# EAGLE design LNOccupancy (EAGLE 7.2.0)

## Sheet 1 of 3
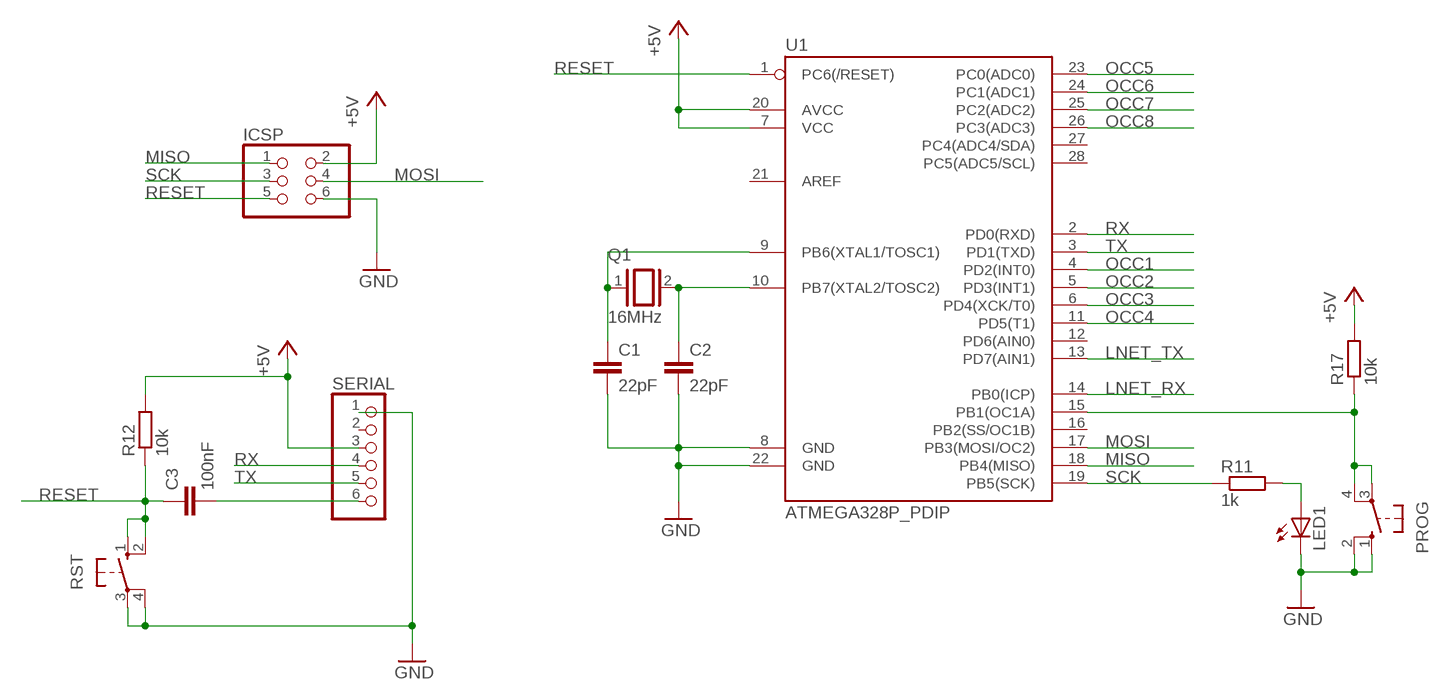
[diagram p0: schematic, sheet 1]

### Parts
C1  22pF  C-EU025-025X050  [C025-025X050]
C2  22pF  C-EU025-025X050  [C025-025X050]
C3  100nF  C-EU050-025X075  [C050-025X075]
ICSP  PINHD-2X3  [2X03]
LED1  LED3MM  [LED3MM]
PROG  10-XX  [B3F-10XX]
Q1  16MHz  XTAL/S  [QS]
R11  1k  R-EU_0207/2V  [0207/2V]
R12  10k  R-EU_0207/2V  [0207/2V]
R17  10k  R-EU_0207/2V  [0207/2V]
RST  10-XX  [B3F-10XX]
SERIAL  PINHD-1X6  [1X06]
U1  ATMEGA328P_PDIP  [DIL28-3]

### Nets
+5V: ICSP.2 R12.2 R17.2 SERIAL.3 U1.7(VCC) U1.20(AVCC) ; also sheet 2
GND: C1.2 C2.2 ICSP.6 LED1.K(C) PROG.1(S) PROG.2(S1) RST.3(P) RST.4(P1) SERIAL.1 U1.8(GND) U1.22(GND) ; also sheet 2,3
LNET_RX: U1.14(PB0(ICP)) ; also sheet 2
LNET_TX: U1.13(PD7(AIN1)) ; also sheet 2
MISO: ICSP.1 U1.18(PB4(MISO))
MOSI: ICSP.4 U1.17(PB3(MOSI/OC2))
N$4: C1.1 Q1.1 U1.9(PB6(XTAL1/TOSC1))
N$6: C2.1 Q1.2 U1.10(PB7(XTAL2/TOSC2))
N$10: LED1.A R11.2
N$11: C3.2 SERIAL.6
N$16: PROG.3(P) PROG.4(P1) R17.1 U1.15(PB1(OC1A))
OCC1: U1.4(PD2(INT0)) ; also sheet 3
OCC2: U1.5(PD3(INT1)) ; also sheet 3
OCC3: U1.6(PD4(XCK/T0)) ; also sheet 3
OCC4: U1.11(PD5(T1)) ; also sheet 3
OCC5: U1.23(PC0(ADC0)) ; also sheet 3
OCC6: U1.24(PC1(ADC1)) ; also sheet 3
OCC7: U1.25(PC2(ADC2)) ; also sheet 3
OCC8: U1.26(PC3(ADC3)) ; also sheet 3
RESET: C3.1 ICSP.5 R12.1 RST.1(S) RST.2(S1) U1.1(PC6(/RESET))
RX: SERIAL.4 U1.2(PD0(RXD))
SCK: ICSP.3 R11.1 U1.19(PB5(SCK))
TX: SERIAL.5 U1.3(PD1(TXD))
Unconnected: SERIAL.2 U1.12(PD6(AIN0)) U1.16(PB2(SS/OC1B)) U1.21(AREF) U1.27(PC4(ADC4/SDA)) U1.28(PC5(ADC5/SCL))

## Sheet 2 of 3
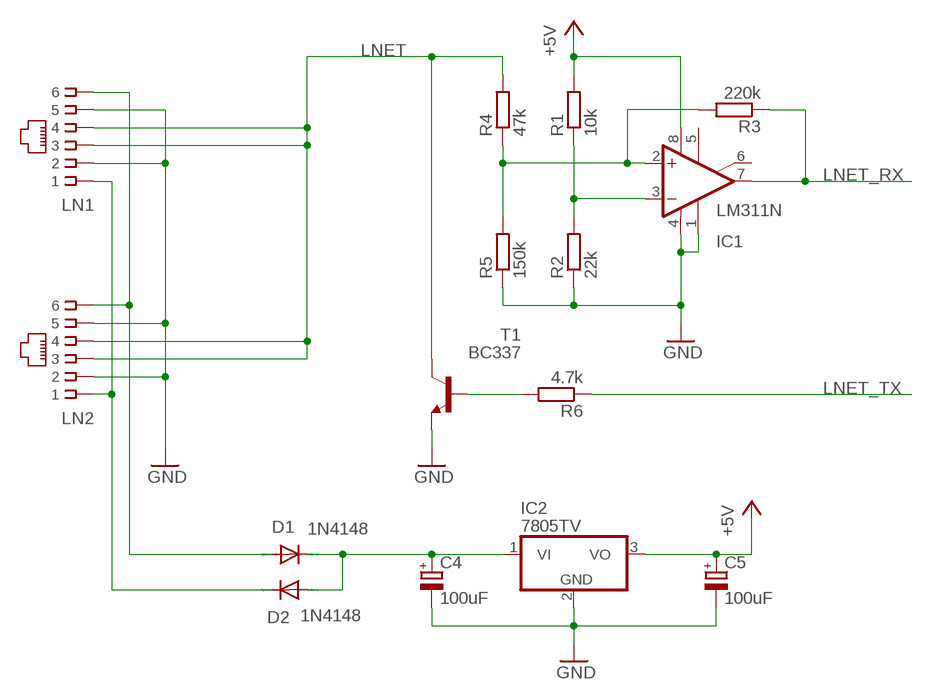
[diagram p1: schematic, sheet 2]

### Parts
C4  100uF  CPOL-EUE2.5-6  [E2,5-6]
C5  100uF  CPOL-EUE2.5-6  [E2,5-6]
D1  1N4148  1N4148DO35-10  [DO35-10]
D2  1N4148  1N4148DO35-10  [DO35-10]
IC1  LM311N  [DIL08]
IC2  7805TV  [TO220V]
LN1  RJ11-6X  [RJ11-NO_SHIELD]
LN2  RJ11-6X  [RJ11-NO_SHIELD]
R1  10k  R-EU_0207/2V  [0207/2V]
R2  22k  R-EU_0207/2V  [0207/2V]
R3  220k  R-EU_0207/2V  [0207/2V]
R4  47k  R-EU_0207/2V  [0207/2V]
R5  150k  R-EU_0207/2V  [0207/2V]
R6  4.7k  R-EU_0207/2V  [0207/2V]
T1  BC337  [TO92]

### Nets
+5V: C5.+ IC1.8(V+) IC2.3(VO) R1.2 ; also sheet 1
GND: C4.- C5.- IC1.1(GND) IC1.4(V-) IC2.2(GND) LN1.2 LN1.5 LN2.2 LN2.5 R2.1 R5.1 T1.1(E) ; also sheet 1,3
LNET: LN1.3 LN1.4 LN2.3 LN2.4 R4.2 T1.3(C)
LNET_RX: IC1.7(OUT) R3.1 ; also sheet 1
LNET_TX: R6.1 ; also sheet 1
N$1: R6.2 T1.2(B)
N$3: IC1.3(-IN) R1.1 R2.2
N$5: IC1.2(+IN) R3.2 R4.1 R5.2
N$17: C4.+ D1.C D2.A IC2.1(VI)
RAILSYNC_A [power]: D1.A LN1.6 LN2.6
RAILSYNC_B [power]: D2.C LN1.1 LN2.1
Unconnected: IC1.5(ON) IC1.6(ON/STR)

## Sheet 3 of 3
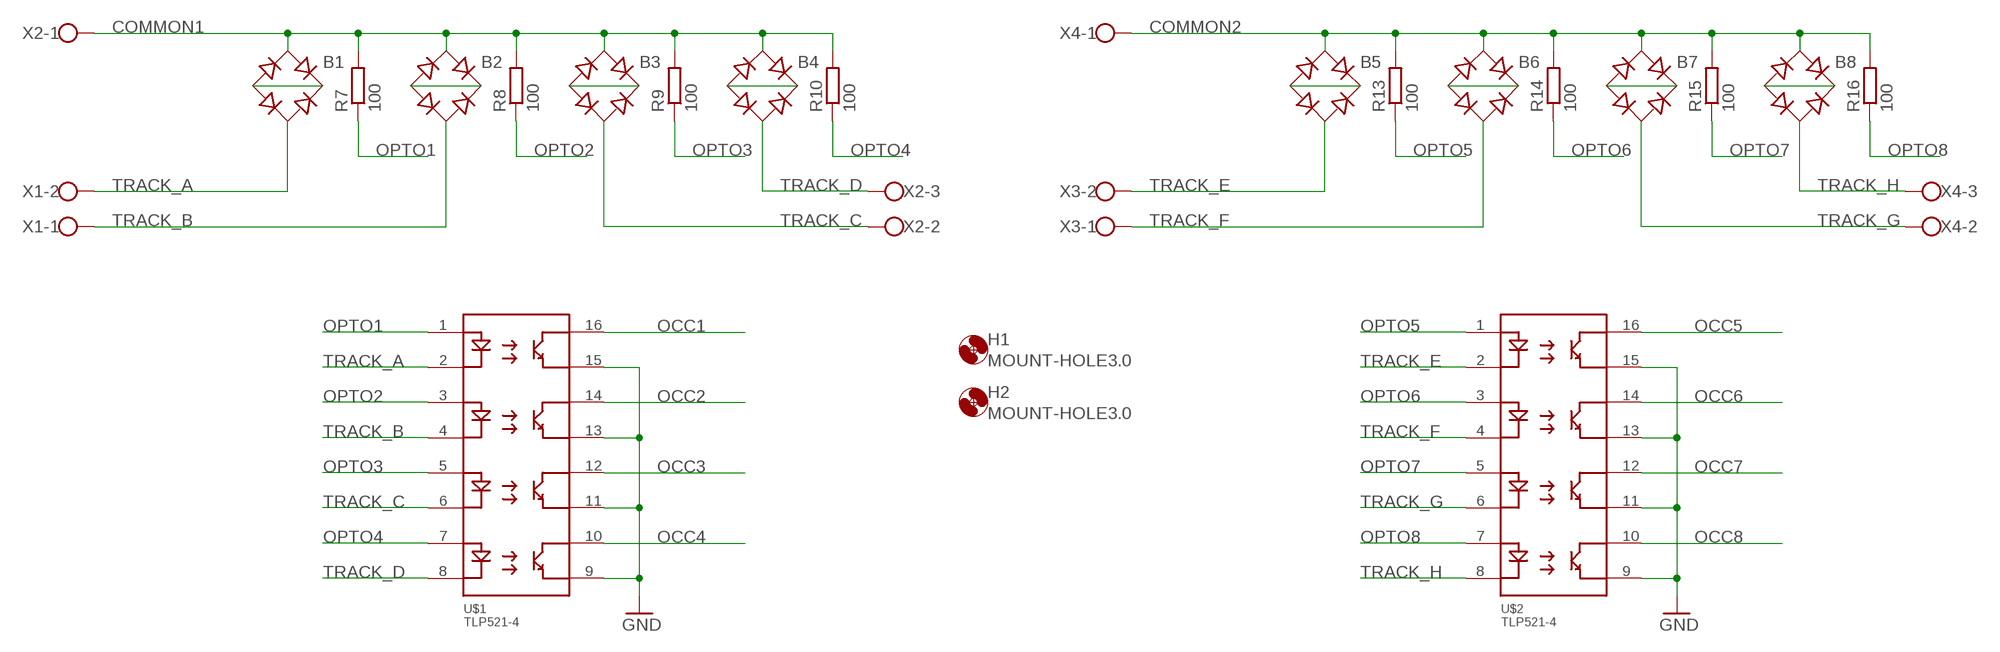
[diagram p2: schematic, sheet 3]

### Parts
B1  RB1A  [RB1A]
B2  RB1A  [RB1A]
B3  RB1A  [RB1A]
B4  RB1A  [RB1A]
B5  RB1A  [RB1A]
B6  RB1A  [RB1A]
B7  RB1A  [RB1A]
B8  RB1A  [RB1A]
H1  MOUNT-HOLE3.0  [3,0]
H2  MOUNT-HOLE3.0  [3,0]
R7  100  R-EU_0207/2V  [0207/2V]
R8  100  R-EU_0207/2V  [0207/2V]
R9  100  R-EU_0207/2V  [0207/2V]
R10  100  R-EU_0207/2V  [0207/2V]
R13  100  R-EU_0207/2V  [0207/2V]
R14  100  R-EU_0207/2V  [0207/2V]
R15  100  R-EU_0207/2V  [0207/2V]
R16  100  R-EU_0207/2V  [0207/2V]
U$1  TLP521-4  [DIL16]
U$2  TLP521-4  [DIL16]
X1  W237-102  [W237-102]
X2  W237-103  [W237-103]
X3  W237-102  [W237-102]
X4  W237-103  [W237-103]

### Nets
COMMON1 [power]: B1.AC1 B2.AC1 B3.AC1 B4.AC1 R7.2 R8.2 R9.2 R10.2 X2.1
COMMON2 [power]: B5.AC1 B6.AC1 B7.AC1 B8.AC1 R13.2 R14.2 R15.2 R16.2 X4.1
GND: U$1.9 U$1.11 U$1.13 U$1.15 U$2.9 U$2.11 U$2.13 U$2.15 ; also sheet 1,2
N$2 [power]: B1.+ B1.-
N$7 [power]: B3.+ B3.-
N$8 [power]: B4.+ B4.-
N$9 [power]: B2.+ B2.-
N$12 [power]: B5.+ B5.-
N$13 [power]: B6.+ B6.-
N$14 [power]: B7.+ B7.-
N$15 [power]: B8.+ B8.-
OCC1: U$1.16 ; also sheet 1
OCC2: U$1.14 ; also sheet 1
OCC3: U$1.12 ; also sheet 1
OCC4: U$1.10 ; also sheet 1
OCC5: U$2.16 ; also sheet 1
OCC6: U$2.14 ; also sheet 1
OCC7: U$2.12 ; also sheet 1
OCC8: U$2.10 ; also sheet 1
OPTO1: R7.1 U$1.1
OPTO2: R8.1 U$1.3
OPTO3: R9.1 U$1.5
OPTO4: R10.1 U$1.7
OPTO5: R13.1 U$2.1
OPTO6: R14.1 U$2.3
OPTO7: R15.1 U$2.5
OPTO8: R16.1 U$2.7
TRACK_A [power]: B1.AC2 U$1.2 X1.2
TRACK_B [power]: B2.AC2 U$1.4 X1.1
TRACK_C [power]: B3.AC2 U$1.6 X2.2
TRACK_D [power]: B4.AC2 U$1.8 X2.3
TRACK_E [power]: B5.AC2 U$2.2 X3.2
TRACK_F [power]: B6.AC2 U$2.4 X3.1
TRACK_G [power]: B7.AC2 U$2.6 X4.2
TRACK_H [power]: B8.AC2 U$2.8 X4.3

## Library data of the parts
B1-B8 = rectifier:RB1A: RECTIFIER 1 A
C1-C3 = rcl:C-EU: CAPACITOR, European symbol
C4 C5 = rcl:CPOL-EU: POLARIZED CAPACITOR, European symbol
D1 D2 = diode:1N4148: DIODE high speed (Philips)
H1 H2 = holes:MOUNT-HOLE: MOUNTING HOLE with drill center marker
IC1 = linear:LM311: COMPARATOR
IC2 = linear:78*: Positive VOLTAGE REGULATOR Source: http://cache.national.com/ds/LM/LM78L05.pdf http://www.fairchildsemi.com/ds/LM/LM7805.pdf
ICSP = pinhead:PINHD-2X3: PIN HEADER
LED1 = led:LED: LED OSRAM: - CHIPLED LG R971, LG N971, LY N971, LG Q971, LY Q971, LO R971, LY R971 LH N974, LH R974 LS Q976, LO Q976, LY Q976 LO Q996 - Hyper CHIPLED LW Q18S LB Q993, LB Q99A, LB R99A - SideLED LS A670, LO A670, LY A670, LG A670, LP A670 LB A673, LV A673, LT A673, LW A673 LH A674 LY A675 LS A676, LA A676, LO A676, LY A676, LW A676 LS A679, LY A679, LG A679 - Hyper Micro SIDELED® LS Y876, LA Y876, LO Y876, LY Y876 LT Y87S - SmartLED LW L88C, LW L88S LB L89C, LB L89S, LG L890 LS L89K, LO L89K, LY L89K LS L896, LA L896, LO L896, LY L896 - TOPLED LS T670, LO T670, LY T670, LG T670, LP T670 LSG T670, LSP T670, LSY T670, LOP T670, LYG T670 LG T671, LOG T671, LSG T671 LB T673, LV T673, LT T673, LW T673 LH T674 LS T676, LA T676, LO T676, LY T676, LB T676, LH T676, LSB T676, LW T676 LB T67C, LV T67C, LT T67C, LS T67K, LO T67K, LY T67K, LW E67C LS E67B, LA E67B, LO E67B, LY E67B, LB E67C, LV E67C, LT E67C LW T67C LS T679, LY T679, LG T679 LS T770, LO T770, LY T770, LG T770, LP T770 LB T773, LV T773, LT T773, LW T773 LH T774 LS E675, LA E675, LY E675, LS T675 LS T776, LA T776, LO T776, LY T776, LB T776 LHGB T686 LT T68C, LB T68C - Hyper Mini TOPLED® LB M676 - Mini TOPLED Santana® LG M470 LS M47K, LO M47K, LY M47K Source: http://www.osram.convergy.de LUXEON: - LUMILED® LXK2-PW12-R00, LXK2-PW12-S00, LXK2-PW14-U00, LXK2-PW14-V00 LXK2-PM12-R00, LXK2-PM12-S00, LXK2-PM14-U00 LXK2-PE12-Q00, LXK2-PE12-R00, LXK2-PE12-S00, LXK2-PE14-T00, LXK2-PE14-U00 LXK2-PB12-K00, LXK2-PB12-L00, LXK2-PB12-M00, LXK2-PB14-N00, LXK2-PB14-P00, LXK2-PB14-Q00 LXK2-PR12-L00, LXK2-PR12-M00, LXK2-PR14-Q00, LXK2-PR14-R00 LXK2-PD12-Q00, LXK2-PD12-R00, LXK2-PD12-S00 LXK2-PH12-R00, LXK2-PH12-S00 LXK2-PL12-P00, LXK2-PL12-Q00, LXK2-PL12-R00 Source: www.luxeon.com KINGBRIGHT: KA-3528ASYC Source: www.kingbright.com
LN1 LN2 = con-tycoelectronics:RJ11: CORCOM Modular RJ Jacks No Shield Source: www.tycoelectronics.com .. ENG_DS_1654001_1099_RJ_L_0507.pdf; MPN: RJ11-6X; OC_FARNELL: unknown; OC_NEWARK: 16R6089
PROG RST = switch-omron:10-XX: OMRON SWITCH; MPN: B3F-1000; OC_FARNELL: 176432; OC_NEWARK: 36M3542
Q1 = special:XTAL/S: CRYSTAL
R1-R17 = rcl:R-EU_: RESISTOR, European symbol
SERIAL = pinhead:PINHD-1X6: PIN HEADER
T1 = transistor:BC337: NPN TRANSISTOR
U1 = SparkFun-DigitalIC:ATMEGA328P_PDIP: uC used in the Arduino 32kb flash, 1k EEPROM, 2k SRAM This is the through-hole version of this chip.
U$1 U$2 = LD:TLP521-4
X1 X3 = con-wago-500:W237-102: WAGO SCREW CLAMP; MPN: 237-102; OC_FARNELL: unknown; OC_NEWARK: 70K9898
X2 X4 = con-wago-500:W237-103: WAGO SCREW CLAMP; MPN: 237-103; OC_FARNELL: unknown; OC_NEWARK: 18M7116

## Net classes
0 default: width 0.254 mm
1 power: width 1.016 mm

## Board
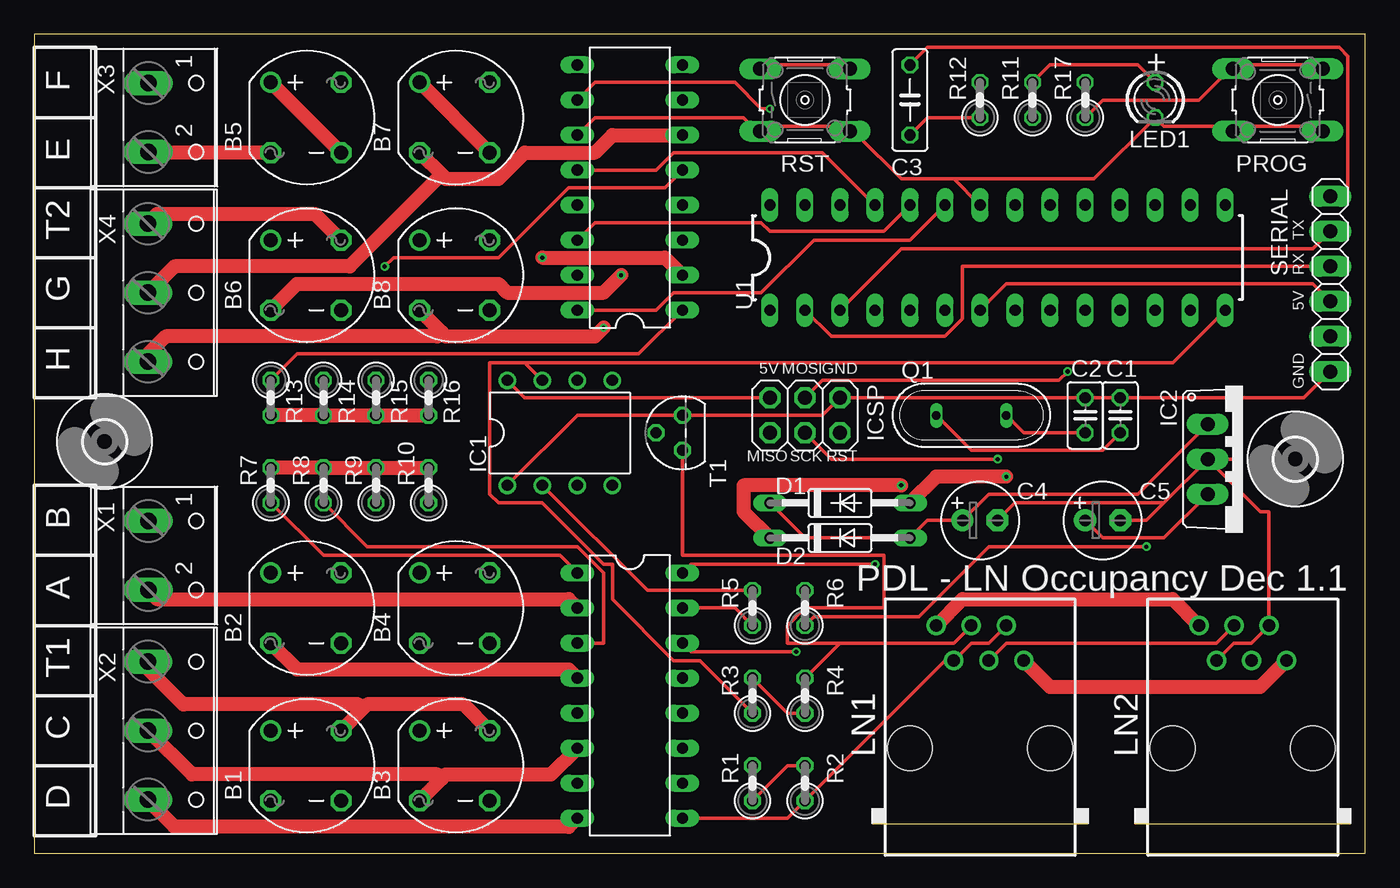
[diagram p3: board, top side]
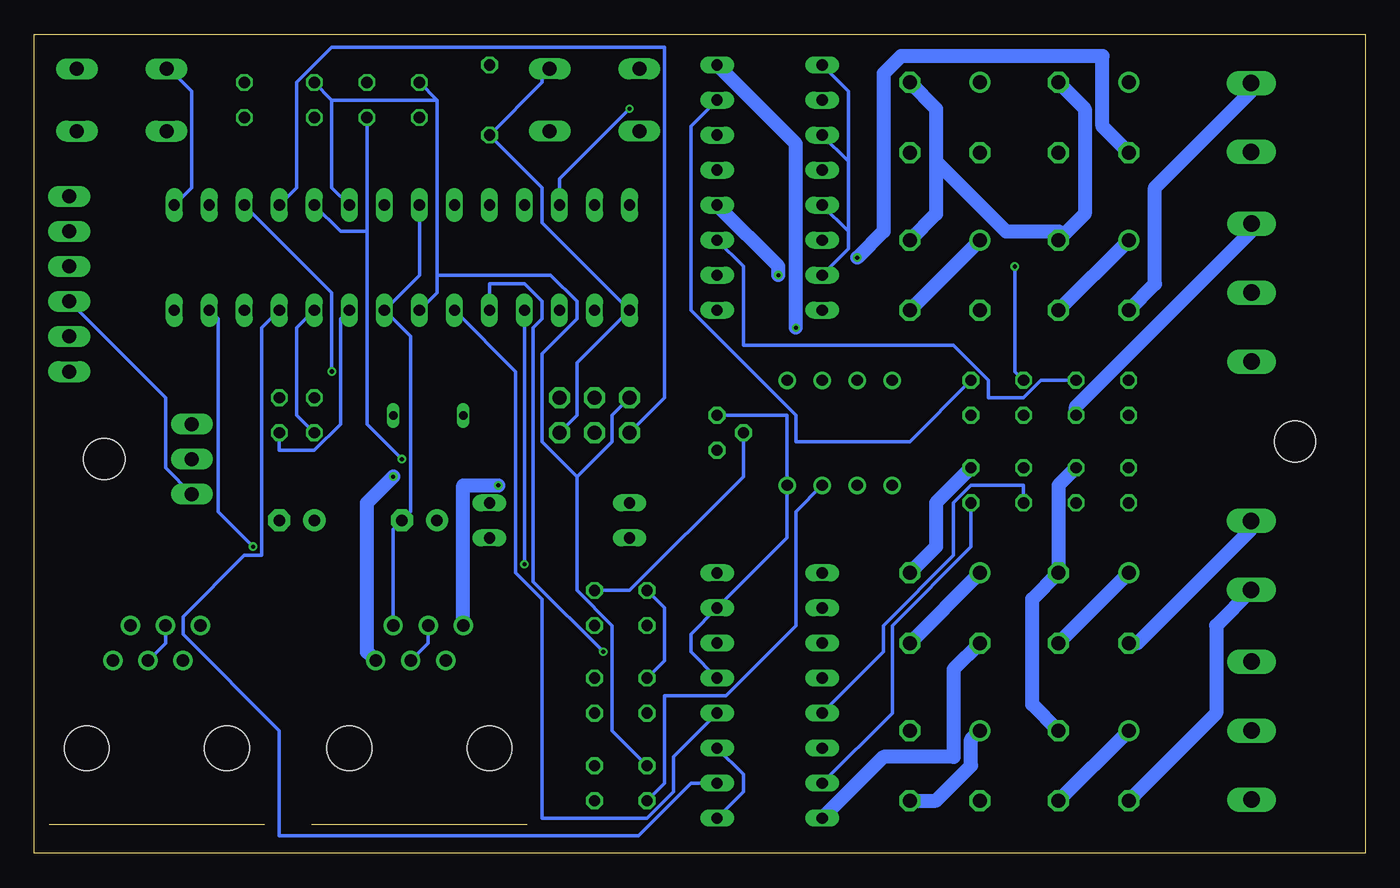
[diagram p4: board, bottom side, seen from below]

Size 96.5 x 59.36 mm. Coordinates in mm from the lower left corner, seen from the top.
Outline: 0,0 96.5,0 96.5,59.36 0,59.36 0,0
Copper layers (1*16): Top 0.035mm / dielectric 1.6mm / Bottom 0.035mm
Design rules "Elecrow_2-layer_PCB_eagle_rule": minimum track width 6mil, minimum drill 12mil, track to track 6mil, track to pad 6mil, pad to pad 6mil, via to via 8mil, smd to smd 0mil, copper to edge 20mil, drill to drill 10mil, minimum pad ring 6mil, minimum via ring 6mil, stop-mask expansion 0mil, vias tented up to drill 100mil, thermal gap 10mil

### Footprints (pad centres in the part's own frame; a part is rotated, then mirrored left to right if it is on the bottom)
RB1A = drill 1.016: + -2.54,2.54 | drill 1.016 octagon: - 2.54,-2.54; AC1 2.54,2.54; AC2 -2.54,-2.54
C025-025X050 = drill 0.813 octagon: 1 -1.27,0; 2 1.27,0
C050-025X075 = drill 0.813 octagon: 1 -2.54,0; 2 2.54,0
E2,5-6 = drill 0.813 pad 1.6: + -1.27,0 | drill 0.813 pad 1.6 octagon: - 1.27,0
DO35-10 = drill 0.813 long: A 5.08,0; C -5.08,0
3,0 = hole 3: 0,0
DIL08 = drill 0.813 pad 1.27: 1 -3.81,-3.81; 2 -1.27,-3.81; 3 1.27,-3.81; 4 3.81,-3.81; 5 3.81,3.81; 6 1.27,3.81; 7 -1.27,3.81; 8 -3.81,3.81
TO220V = drill 1.016 long: 1 -2.54,-2.54; 2 0,-2.54; 3 2.54,-2.54
2X03 = drill 1.016 octagon: 1 -2.54,-1.27; 2 -2.54,1.27; 3 0,-1.27; 4 0,1.27; 5 2.54,-1.27; 6 2.54,1.27
LED3MM = drill 0.813 octagon: A -1.27,0; K 1.27,0
RJ11-NO_SHIELD = drill 0.9 pad 1.4: 1 -3.175,8.89; 2 -1.905,6.35; 3 -0.635,8.89; 4 0.635,6.35; 5 1.905,8.89; 6 3.175,6.35 | hole 3.251: -5.08,0; 5.08,0
B3F-10XX = drill 1.016 long: 1 -3.251,2.261; 2 3.251,2.261; 3 -3.251,-2.261; 4 3.251,-2.261
QS = drill 0.61 long: 1 -2.54,0; 2 2.54,0
0207/2V = drill 0.813 octagon: 1 -1.27,0; 2 1.27,0
1X06 = drill 1.016 long: 1 -6.35,0; 2 -3.81,0; 3 -1.27,0; 4 1.27,0; 5 3.81,0; 6 6.35,0
TO92 = drill 0.813 octagon: 1 1.27,0; 2 0,1.905; 3 -1.27,0
DIL28-3 = drill 0.813 long: 1 -16.51,-3.81; 2 -13.97,-3.81; 3 -11.43,-3.81; 4 -8.89,-3.81; 5 -6.35,-3.81; 6 -3.81,-3.81; 7 -1.27,-3.81; 8 1.27,-3.81; 9 3.81,-3.81; 10 6.35,-3.81; 11 8.89,-3.81; 12 11.43,-3.81; 13 13.97,-3.81; 14 16.51,-3.81; 15 16.51,3.81; 16 13.97,3.81; 17 11.43,3.81; 18 8.89,3.81; 19 6.35,3.81; 20 3.81,3.81; 21 1.27,3.81; 22 -1.27,3.81; 23 -3.81,3.81; 24 -6.35,3.81; 25 -8.89,3.81; 26 -11.43,3.81; 27 -13.97,3.81; 28 -16.51,3.81
DIL16 = drill 0.813 long: 1 -8.89,-3.81; 2 -6.35,-3.81; 3 -3.81,-3.81; 4 -1.27,-3.81; 5 1.27,-3.81; 6 3.81,-3.81; 7 6.35,-3.81; 8 8.89,-3.81; 9 8.89,3.81; 10 6.35,3.81; 11 3.81,3.81; 12 1.27,3.81; 13 -1.27,3.81; 14 -3.81,3.81; 15 -6.35,3.81; 16 -8.89,3.81
W237-102 = drill 1.194 long: 1 -2.5,-1.27; 2 2.5,-1.27
W237-103 = drill 1.194 long: 1 -5,-1.29; 2 0,-1.29; 3 5,-1.29

### Placement (x,y rotation side)
B1  19.68,6.35 0 top
B2  19.68,17.78 0 top
B3  30.48,6.35 0 top
B4  30.48,17.78 0 top
B5  19.68,53.34 0 top
B6  19.68,41.91 0 top
B7  30.48,53.34 0 top
B8  30.48,41.91 0 top
C1  78.74,31.75 90 top
C2  76.2,31.75 90 top
C3  63.5,54.61 90 top
C4  68.58,24.13 0 top
C5  77.47,24.13 0 top
D1  58.42,25.4 0 top
D2  58.42,22.86 0 top
H1  91.44,28.57 0 top
H2  5.08,29.84 0 top
IC1  38.1,30.48 0 top
IC2  87.63,28.57 270 top
ICSP  55.88,31.75 0 top
LED1  81.28,54.61 270 top
LN1  68.58,7.62 0 top
LN2  87.63,7.62 0 top
PROG  90.17,54.61 180 top
Q1  67.94,31.75 0 top
R1  52.07,5.08 90 top
R2  55.88,5.08 90 top
R3  52.07,11.43 90 top
R4  55.88,11.43 90 top
R5  52.07,17.78 90 top
R6  55.88,17.78 90 top
R7  17.14,26.67 90 top
R8  20.95,26.67 90 top
R9  24.77,26.67 90 top
R10  28.57,26.67 90 top
R11  72.39,54.61 90 top
R12  68.58,54.61 90 top
R13  17.14,33.02 270 top
R14  20.95,33.02 270 top
R15  24.77,33.02 270 top
R16  28.57,33.02 270 top
R17  76.2,54.61 90 top
RST  55.88,54.61 0 top
SERIAL  93.98,41.27 90 top
T1  46.99,30.48 90 top
U1  69.85,43.18 0 top
U$1  43.18,11.43 270 top
U$2  43.18,48.26 90 top
X1  9.53,21.59 270 top
X2  9.53,8.89 270 top
X3  9.53,53.34 270 top
X4  9.53,40.64 270 top

### Tracks (layer width: path | path; a pad name or v marks a point on that pad's centre or on a via)
+5V
  Top 0.254: IC1.8 35.56,33.02 ICSP.2 | IC2.3 81.92,22.86 77.47,22.86 C5.+ | U1.7 70.48,41.27 92.71,41.27 SERIAL.3
  Bottom 0.254: R1.2 54.61,8.89 54.61,16.51 57.15,19.05 57.15,27.3 | 57.15,27.3 54.61,29.84 54.61,31.75 ICSP.2 | U1.20 74.93,48.26 74.93,54.61 | R17.2 74.93,54.61 | U1.7 67.31,40.64 67.31,41.91 | 67.31,54.61 67.31,41.91 | R12.2 67.31,54.61 | 67.31,54.61 74.93,54.61 | SERIAL.3 87,33.02 87,27.94 IC2.3 | 57.15,27.3 59.69,29.84 59.69,36.2 57.15,38.73 57.15,40.01 59.05,41.91 67.31,41.91
COMMON1
  Top 1.016: R7.2 R8.2 R9.2 R10.2 | 23.81,10.48 24.13,10.79 31.11,10.79 B3.AC1 | 23.81,10.48 B1.AC1 | X2.1 8.26,13.34 10.79,10.79 23.5,10.79 23.81,10.48
  Bottom 1.016: R8.2 22.23,26.67 B2.AC1 24.13,18.41 24.13,10.79 B1.AC1 | B4.AC1 31.11,22.23 31.11,25.4 R10.2
COMMON2
  Top 1.016: R13.2 R14.2 R15.2 R16.2 | B6.AC1 20.32,46.35 8.89,46.35 8.26,45.72 X4.1
  Bottom 1.016: B5.AC1 20.32,53.98 20.32,46.35 B6.AC1 22.23,45.09 26.04,45.09 31.11,50.16 | B8.AC1 31.11,46.35 31.11,50.16 | 31.11,50.16 31.11,53.98 B7.AC1 | R14.2 20.95,32.38 8.26,45.09 X4.1
GND
  Top 0.254: PROG.1 93.34,52.7 87,52.7 PROG.2 86.36,52.7 81.92,52.7 LED1.K 76.83,48.9 66.67,48.9 | 66.67,48.9 62.87,48.9 59.69,52.07 RST.4 59.05,52.7 52.7,52.7 RST.3 52.07,52.7 51.44,53.34 40.64,53.34 U$2.11 | U1.22 66.67,48.9 | U$1.9 54.61,2.54 R2.1 66.04,13.97 LN1.2 67.94,15.24 69.22,15.24 LN1.5 | SERIAL.1 92.08,33.02 87,33.02 | 87,33.02 C1.2 C2.2 ICSP.6 57.15,31.75 T1.1 39.37,31.75 IC1.1 | LN2.2 87,15.24 88.27,15.24 LN2.5 89.53,24.77 88.9,24.77 IC2.2 | 81.92,25.4 80.64,24.13 C5.- | 81.92,25.4 IC2.2 | 87,33.02 87,28.57 IC2.2 | R5.1 50.8,17.78 U$1.15 | C4.- 71.12,25.4 81.92,25.4
  Bottom 0.254: U$2.15 37.47,43.81 37.47,45.09 | U$2.13 37.47,45.09 | 37.47,50.16 U$2.11 | 37.47,45.09 37.47,50.16 | U$2.9 37.47,55.24 37.47,50.16 | U1.22 68.58,41.91 U1.8 69.22,37.47 69.22,24.77 C4.- 70.48,23.5 LN1.5 | U$1.9 45.09,4.45 45.09,5.71 U$1.11 | U$1.13 48.9,14.61 48.9,15.88 U$1.15 41.91,22.86 IC1.4 41.91,31.75 T1.1
LNET
  Top 0.254: 58.42,15.24 R4.2 | 58.42,15.24 66.67,15.24 LN1.3 | T1.3 46.99,21.59 61.59,21.59 61.59,17.78 55.88,17.78 54.61,16.51 54.61,15.24 58.42,15.24 | LN2.3 85.72,15.24 70.48,15.24 LN1.4
  Bottom 0.254: LN2.4 87,15.24 LN2.3 | LN1.4 67.94,15.24 LN1.3
LNET_RX
  Top 0.254: R3.1 48.26,13.97 46.35,13.97 41.91,18.41 41.91,20.95 41.27,20.95 36.83,25.4 33.66,25.4 33.02,26.04 33.02,35.56 35.56,35.56 | IC1.7 35.56,35.56 | U1.14 82.55,35.56 35.56,35.56
LNET_TX  (via drill 0.3)
  Top 0.254: R6.1 56.52,17.14 64.14,17.14 69.22,22.23 v80.64,22.23
  Bottom 0.254: v80.64,22.23 83.19,24.77 83.19,38.73 U1.13
MISO
  Bottom 0.254: U1.18 77.47,48.26 77.47,55.88 74.93,58.42 50.8,58.42 50.8,33.02 ICSP.1
MOSI  (via drill 0.3)
  Top 0.254: v74.93,34.92 74.3,34.29 57.15,34.29 ICSP.4
  Bottom 0.254: U1.17 74.93,40.64 v74.93,34.92
N$1
  Bottom 0.254: R6.2 53.34,19.05 45.09,27.3 T1.2
N$2
  Bottom 1.016: B1.- B1.+
N$3
  Top 0.254: R1.1 54.61,6.35 R2.2
  Bottom 0.254: IC1.3 41.27,24.77 41.27,16.51 46.35,11.43 50.8,11.43 50.8,5.08 R1.1
N$4
  Top 0.254: Q1.1 67.94,29.21 77.47,29.21 C1.1
  Bottom 0.254: U1.9 74.3,38.73 74.3,31.11 76.2,29.21 78.74,29.21 C1.1
N$5
  Top 0.254: R3.2 54.61,10.16 R4.1 | IC1.2 44.45,19.05 R5.2
  Bottom 0.254: R5.2 50.8,17.78 50.8,13.97 R3.2
N$6
  Top 0.254: Q1.2 71.75,30.48 C2.1
  Bottom 0.254: U1.10 77.47,38.1 77.47,31.75 C2.1
N$7
  Bottom 1.016: B3.+ 28.57,8.26 28.57,6.35 31.11,3.81 B3.-
N$8
  Bottom 1.016: B4.- B4.+
N$9
  Bottom 1.016: B2.- B2.+
N$10
  Top 0.254: R11.2 73.66,57.15 80.01,57.15 LED1.A
N$11
  Top 0.254: C3.2 64.77,58.42 94.61,58.42 95.25,57.78 95.25,47.62 SERIAL.6
N$12
  Top 1.016: B5.- B5.+
N$13
  Bottom 1.016: B6.- B6.+
N$14
  Top 1.016: B7.- B7.+
N$15
  Bottom 1.016: B8.- B8.+
N$16
  Top 0.254: R17.1 77.47,54.61 84.45,54.61 86.36,56.52 PROG.4 87,57.15 93.34,57.15 PROG.3
  Bottom 0.254: U1.15 85.09,48.26 85.09,55.24 86.36,56.52 PROG.4
N$17
  Top 0.254: D1.C 55.88,22.86 D2.A 64.77,24.13 C4.+ 69.22,26.04 80.01,26.04 IC2.1
OCC1  (via drill 0.3)
  Top 0.254: U$1.16 47.62,20.95 v60.96,20.95
  Bottom 0.254: U1.4 v60.96,20.95
OCC2  (via drill 0.3)
  Top 0.254: U$1.14 47.62,14.61 v55.24,14.61
  Bottom 0.254: v55.24,14.61 60.33,19.68 60.33,38.1 59.69,38.73 59.69,40.01 60.96,41.27 63.5,41.27 U1.5
OCC3
  Bottom 0.254: U$1.12 50.16,6.99 50.16,4.45 52.07,2.54 59.69,2.54 59.69,18.41 61.59,20.32 61.59,34.92 U1.6
OCC4
  Bottom 0.254: U$1.10 48.9,5.08 52.7,1.27 78.74,1.27 78.74,8.89 85.72,15.88 85.72,17.14 81.28,21.59 80.01,21.59 80.01,38.1 U1.11
OCC5
  Top 0.254: U$2.16 45.09,39.37 46.35,40.64 52.7,40.64 56.52,44.45 63.5,44.45 U1.23
OCC6
  Top 0.254: U$2.14 40.64,45.72 52.7,45.72 53.34,45.09 61.59,45.09 U1.24
OCC7
  Top 0.254: U$2.12 45.09,49.53 46.35,50.8 57.15,50.8 U1.25
OCC8  (via drill 0.3)
  Top 0.254: U$2.10 40.64,55.88 50.8,55.88 52.7,53.98 v53.34,53.98
  Bottom 0.254: v53.34,53.98 58.42,48.9 U1.26
OPTO1
  Top 0.254: R7.1 20.95,21.59 38.1,21.59 U$1.1
OPTO2
  Top 0.254: R8.1 24.13,22.23 39.37,22.23 41.27,20.32 41.27,15.24 U$1.3
OPTO3
  Bottom 0.254: U$1.5 34.92,14.61 34.92,16.51 29.84,21.59 29.84,25.4 28.57,26.67 24.77,26.67 R9.1
OPTO4
  Bottom 0.254: U$1.7 34.29,10.16 34.29,16.51 28.57,22.23 R10.1
OPTO5
  Top 0.254: R13.1 19.05,36.2 43.81,36.2 U$2.1
OPTO6
  Bottom 0.254: R14.1 23.5,34.29 24.77,33.02 27.3,33.02 27.3,34.29 29.84,36.83 45.09,36.83 45.09,42.55 U$2.3
OPTO7  (via drill 0.3)
  Top 0.254: v25.4,42.55 26.04,43.18 33.66,43.18 38.73,48.26 45.72,48.26 U$2.5
  Bottom 0.254: R15.1 25.4,34.92 v25.4,42.55
OPTO8
  Bottom 0.254: R16.1 33.02,29.84 41.27,29.84 41.27,31.75 48.9,39.37 48.9,52.7 U$2.7
RAILSYNC_A  (via drill 0.3)
  Top 1.016: D1.A 65.41,27.3 v70.48,27.3 | LN2.6 88.9,12.06 73.66,12.06 LN1.6
  Bottom 1.016: v70.48,27.3 72.39,25.4 72.39,14.61 LN1.6
RAILSYNC_B  (via drill 0.3)
  Top 1.016: D2.C 51.44,24.77 51.44,26.67 v62.87,26.67 | LN2.1 82.55,18.41 67.31,18.41 LN1.1
  Bottom 1.016: v62.87,26.67 65.41,26.67 LN1.1
RESET
  Top 0.254: C3.1 64.77,53.34 R12.1 | RST.1 52.7,57.15 59.05,57.15 RST.2
  Bottom 0.254: ICSP.5 57.15,31.75 57.15,35.56 U1.1 59.69,45.72 59.69,48.26 C3.1 59.69,55.88 59.69,56.52 RST.2
RX
  Top 0.254: U1.2 57.78,37.47 66.04,37.47 67.31,38.73 67.31,42.55 SERIAL.4
SCK  (via drill 0.3)
  Top 0.254: ICSP.3 57.78,28.57 v69.85,28.57
  Bottom 0.254: U1.19 74.3,45.09 72.39,45.09 | R11.1 72.39,45.09 | v69.85,28.57 72.39,31.11 72.39,45.09
TRACK_A
  Top 1.016: U$1.2 38.73,18.41 8.89,18.41 8.26,19.05 X1.2
  Bottom 1.016: B1.AC2 10.79,10.16 10.79,16.51 8.26,19.05 X1.2
TRACK_B
  Top 1.016: U$1.4 38.73,13.34 19.05,13.34 B2.AC2
  Bottom 1.016: B2.AC2 16.51,15.24 8.26,23.5 X1.1
TRACK_C
  Top 1.016: U$1.6 37.47,5.71 29.84,5.71 29.53,5.4 | B3.AC2 29.53,5.4 | X2.2 8.26,8.89 11.43,5.71 29.21,5.71 29.53,5.4
TRACK_D
  Top 1.016: U$1.8 38.73,1.91 10.16,1.91 8.26,3.81 X2.3
  Bottom 1.016: U$1.8 34.92,6.99 29.84,6.99 29.84,13.34 B4.AC2
TRACK_E  (via drill 0.3)
  Top 1.016: U$2.2 45.72,43.18 v36.83,43.18 | B5.AC2 8.26,50.8 X3.2
  Bottom 1.016: v36.83,43.18 34.92,45.09 34.92,56.52 33.66,57.78 19.05,57.78 19.05,52.7 B5.AC2
TRACK_F  (via drill 0.3)
  Top 1.016: v42.55,41.91 41.27,40.64 34.29,40.64 33.66,41.27 19.05,41.27 B6.AC2
  Bottom 1.016: U$2.4 42.55,42.55 v42.55,41.91 | B6.AC2 15.24,41.27 15.24,48.26 8.26,55.24 X3.1
TRACK_G
  Top 1.016: U$2.6 41.91,52.07 40.64,50.8 35.56,50.8 33.66,48.9 29.84,48.9 29.53,49.21 | B7.AC2 29.53,49.21 | 29.53,49.21 22.86,42.55 10.16,42.55 8.26,40.64 X4.2
TRACK_H  (via drill 0.3)
  Top 1.016: v41.27,38.1 40.64,37.47 29.84,37.47 29.53,37.78 | B8.AC2 29.53,37.78 | X4.3 8.26,36.2 9.53,37.47 29.21,37.47 29.53,37.78
  Bottom 1.016: U$2.8 41.27,51.44 v41.27,38.1
TX
  Top 0.254: U1.3 62.87,43.81 92.71,43.81 SERIAL.5

### Text on the board
tPlace: F | E | T2 | G | H | B | A | T1 | C | D
tNames: + | TX | RX | 5V | 5V | MOSI | GND | GND | MISO | SCK | RST | PDL - LN Occupancy Dec 1.1